# EAGLE design expansion_module_test_pads (EAGLE 9.6.2)
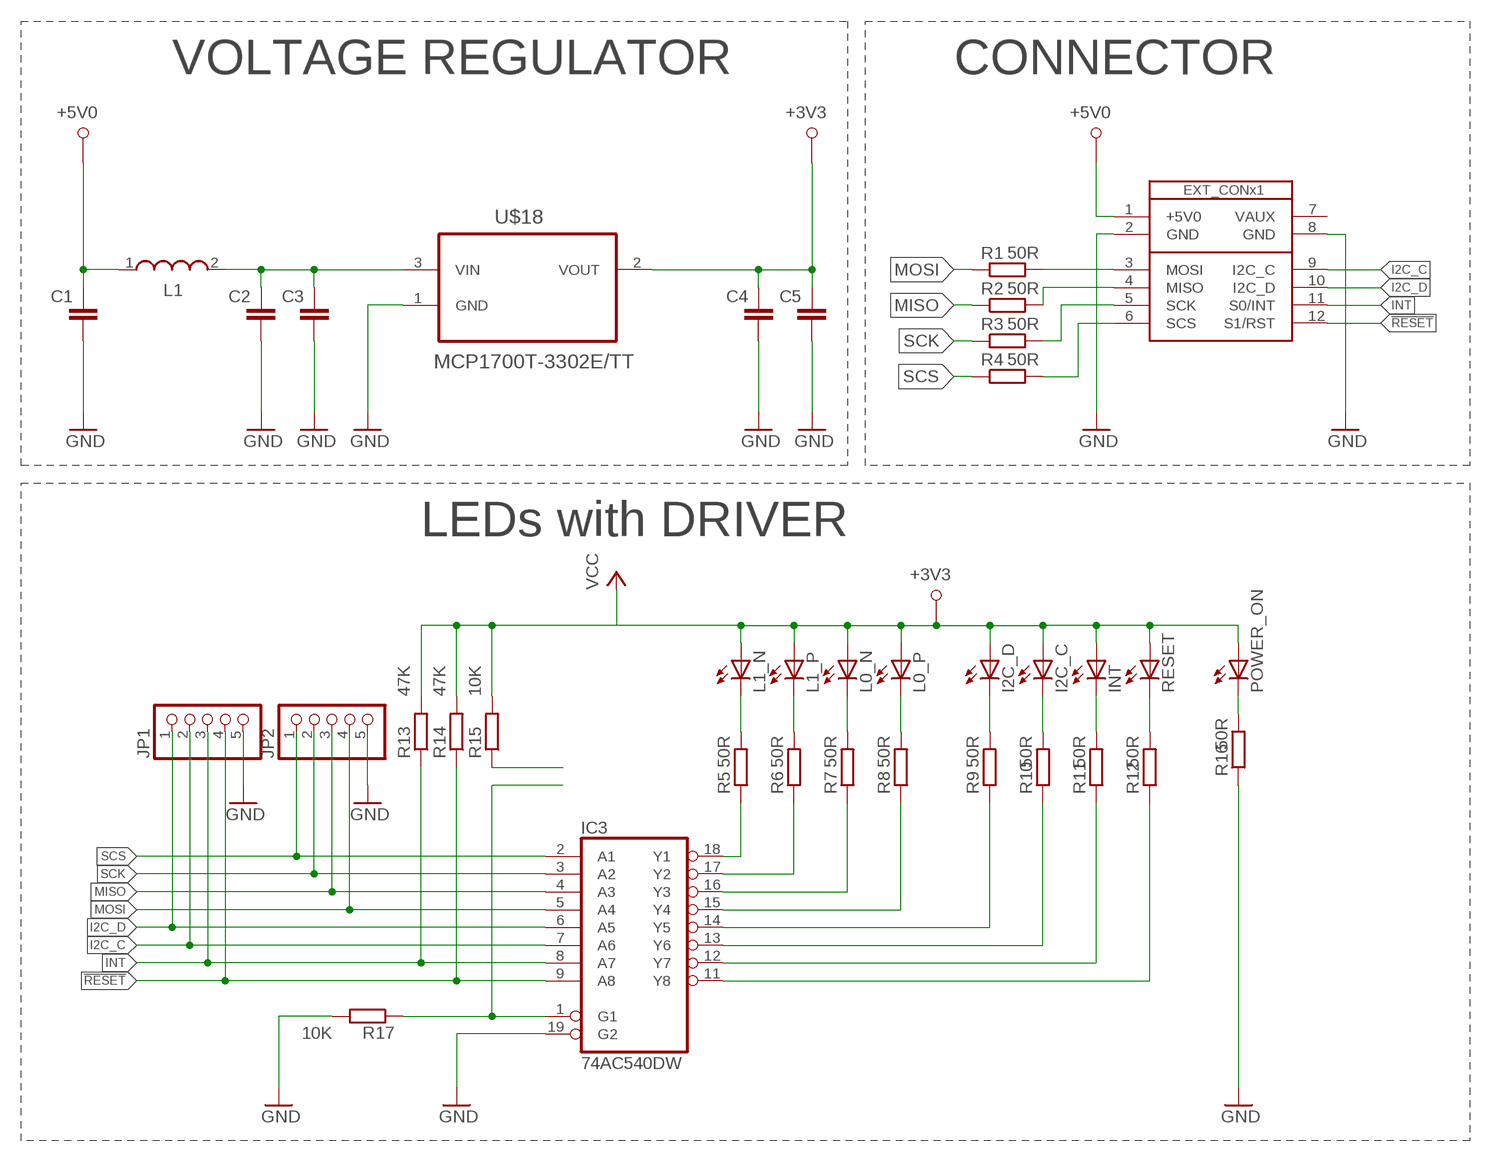
[diagram p0: schematic, sheet 1]

## Parts
C1  C-EUC0805  [C0805]
C2  C-EUC0805  [C0805]
C3  C-EUC0805  [C0805]
C4  C-EUC0805  [C0805]
C5  C-EUC0805  [C0805]
I2C_C  LEDCHIPLED_0805  [CHIPLED_0805]
I2C_D  LEDCHIPLED_0805  [CHIPLED_0805]
IC3  74AC540DW  [SO20W]
INT  LEDCHIPLED_0805  [CHIPLED_0805]
JP1  PINHD-1X5  [1X05]
JP2  PINHD-1X5  [1X05]
L0_N  LEDCHIPLED_0805  [CHIPLED_0805]
L0_P  LEDCHIPLED_0805  [CHIPLED_0805]
L1  WE-LQ_1210  [WE-LQ_M]
L1_N  LEDCHIPLED_0805  [CHIPLED_0805]
L1_P  LEDCHIPLED_0805  [CHIPLED_0805]
POWER_ON  LEDCHIPLED_0805  [CHIPLED_0805]
R1  50R  R-EU_R0805  [R0805]
R2  50R  R-EU_R0805  [R0805]
R3  50R  R-EU_R0805  [R0805]
R4  50R  R-EU_R0805  [R0805]
R5  50R  R-EU_R0805  [R0805]
R6  50R  R-EU_R0805  [R0805]
R7  50R  R-EU_R0805  [R0805]
R8  50R  R-EU_R0805  [R0805]
R9  50R  R-EU_R0805  [R0805]
R10  50R  R-EU_R0805  [R0805]
R11  50R  R-EU_R0805  [R0805]
R12  50R  R-EU_R0805  [R0805]
R13  47K  R-EU_R0805  [R0805]
R14  47K  R-EU_R0805  [R0805]
R15  10K  R-EU_R0805  [R0805]
R16  50R  R-EU_R0805  [R0805]
R17  10K  R-EU_R0805  [R0805]
RESET  LEDCHIPLED_0805  [CHIPLED_0805]
U$1  SB_EXT_CON_X1_SPI  [SB_EXT_CON_X1_FULL]
U$18  MCP1700T-3302E/TT  [SOT95P237X112-3N]

## Nets
!RESET: IC3.9(A8) JP1.4 R14.1 U$1.12(S1/RST)
+3V3: C4.2 C5.2 I2C_C.A I2C_D.A INT.A L0_N.A L0_P.A L1_N.A L1_P.A POWER_ON.A R13.2 R14.2 R15.2 RESET.A U$18.2(VOUT)
+5V0: C1.2 L1.1 U$1.1(+5V0)
GND: C1.1 C2.1 C3.1 C4.1 C5.1 IC3.19(G2) JP1.5 JP2.5 R16.1 R17.2 U$1.2(GND) U$1.8(GND) U$18.1(GND)
I2C_C: IC3.7(A6) JP1.2 U$1.9(I2C_C)
I2C_D: IC3.6(A5) JP1.1 U$1.10(I2C_D)
INT: IC3.8(A7) JP1.3 R13.1 U$1.11(S0/INT)
MISO: IC3.4(A3) JP2.3 R2.1
MOSI: IC3.5(A4) JP2.4 R1.1
N$1: R1.2 U$1.3(MOSI)
N$2: R2.2 U$1.4(MISO)
N$3: R3.2 U$1.5(SCK)
N$4: R4.2 U$1.6(SCS)
N$5: IC3.18(Y1) R5.1
N$6: IC3.17(Y2) R6.1
N$7: IC3.16(Y3) R7.1
N$8: C2.2 C3.2 L1.2 U$18.3(VIN)
N$9: IC3.15(Y4) R8.1
N$11: IC3.14(Y5) R9.1
N$12: IC3.13(Y6) R10.1
N$13: IC3.12(Y7) R11.1
N$14: IC3.11(Y8) R12.1
N$15: L1_N.C R5.2
N$16: L1_P.C R6.2
N$17: L0_N.C R7.2
N$18: L0_P.C R8.2
N$19: I2C_D.C R9.2
N$20: I2C_C.C R10.2
N$21: INT.C R11.2
N$22: R12.2 RESET.C
N$23: POWER_ON.C R16.2
N$24: IC3.1(G1) R17.1
N$25: R15.1
SCK: IC3.3(A2) JP2.2 R3.1
SCS: IC3.2(A1) JP2.1 R4.1
Unconnected: U$1.7(VAUX)

## Notes on the sheet
- VOLTAGE REGULATOR | CONNECTOR
- LEDs with DRIVER

## Power pins joined to a net without a drawn wire
GND: IC3.10(GND)
VCC: IC3.20(VCC)

## Library data of the parts
C1-C5 = resistor:C-EU: CAPACITOR, European symbol
I2C_C I2C_D INT L0_N L0_P L1_N L1_P POWER_ON RESET = led:LED: LED OSRAM: - CHIPLED LG R971, LG N971, LY N971, LG Q971, LY Q971, LO R971, LY R971 LH N974, LH R974 LS Q976, LO Q976, LY Q976 LO Q996 - Hyper CHIPLED LW Q18S LB Q993, LB Q99A, LB R99A - SideLED LS A670, LO A670, LY A670, LG A670, LP A670 LB A673, LV A673, LT A673, LW A673 LH A674 LY A675 LS A676, LA A676, LO A676, LY A676, LW A676 LS A679, LY A679, LG A679 - Hyper Micro SIDELED® LS Y876, LA Y876, LO Y876, LY Y876 LT Y87S - SmartLED LW L88C, LW L88S LB L89C, LB L89S, LG L890 LS L89K, LO L89K, LY L89K LS L896, LA L896, LO L896, LY L896 - TOPLED LS T670, LO T670, LY T670, LG T670, LP T670 LSG T670, LSP T670, LSY T670, LOP T670, LYG T670 LG T671, LOG T671, LSG T671 LB T673, LV T673, LT T673, LW T673 LH T674 LS T676, LA T676, LO T676, LY T676, LB T676, LH T676, LSB T676, LW T676 LB T67C, LV T67C, LT T67C, LS T67K, LO T67K, LY T67K, LW E67C LS E67B, LA E67B, LO E67B, LY E67B, LB E67C, LV E67C, LT E67C LW T67C LS T679, LY T679, LG T679 LS T770, LO T770, LY T770, LG T770, LP T770 LB T773, LV T773, LT T773, LW T773 LH T774 LS E675, LA E675, LY E675, LS T675 LS T776, LA T776, LO T776, LY T776, LB T776 LHGB T686 LT T68C, LB T68C - Hyper Mini TOPLED® LB M676 - Mini TOPLED Santana® LG M470 LS M47K, LO M47K, LY M47K Source: http://www.osram.convergy.de LUXEON: - LUMILED® LXK2-PW12-R00, LXK2-PW12-S00, LXK2-PW14-U00, LXK2-PW14-V00 LXK2-PM12-R00, LXK2-PM12-S00, LXK2-PM14-U00 LXK2-PE12-Q00, LXK2-PE12-R00, LXK2-PE12-S00, LXK2-PE14-T00, LXK2-PE14-U00 LXK2-PB12-K00, LXK2-PB12-L00, LXK2-PB12-M00, LXK2-PB14-N00, LXK2-PB14-P00, LXK2-PB14-Q00 LXK2-PR12-L00, LXK2-PR12-M00, LXK2-PR14-Q00, LXK2-PR14-R00 LXK2-PD12-Q00, LXK2-PD12-R00, LXK2-PD12-S00 LXK2-PH12-R00, LXK2-PH12-S00 LXK2-PL12-P00, LXK2-PL12-Q00, LXK2-PL12-R00 Source: www.luxeon.com KINGBRIGHT: KA-3528ASYC Source: www.kingbright.com
IC3 = 74xx-eu:74*540: Inverting Octal BUFFER and LINE DRIVER, 3-state
JP1 JP2 = pinhead:PINHD-1X5: PIN HEADER
L1 = EagleLibrary_Wuerth_Elektronik_eiSos_rev16a:WE-LQ: SMD Inductor Characteristics Miniature chip inductor wound on a special ferrite core Small inductances for compact circuits High Q at high frequencies Low DC-resistance Operating temperature: –40 ºC to +125 ºC Applications Low power DC/DC-converters from Linear Technology, National Semiconductor, Texas Instruments, Fairchild Semiconductor, ON Semiconductor, STMicroelectronics, Maxim, MPS, Semtech, Exar, Analogic Tech, Diodes and Cologne Chip EMI-Filtering RF-circuits <http://katalog.we-online.de/media/images/eisos/IndLQ_pf2.jpg> Details see: http://katalog.we-online.de/en/pbs/WE-LQ? Updated by Dan Xu 2014-07-08 2014 (C) Wurth Elektronik
R1-R17 = resistor:R-EU_: RESISTOR, European symbol
U$1 = al_smartboard:SB_EXT_CON_X1_SPI
U$18 = Microchip_By_element14_Batch_1:MCP1700T-3302E/TT: Low Quiescent Current LDO; MPN: MCP1700T-3302E/TT; OC_FARNELL: 1296592; OC_NEWARK: 88H9817; PACKAGE: SOT23-3; SUPPLIER: Microchip

## Net classes
0 default: clearance 0.205 mm

## Board
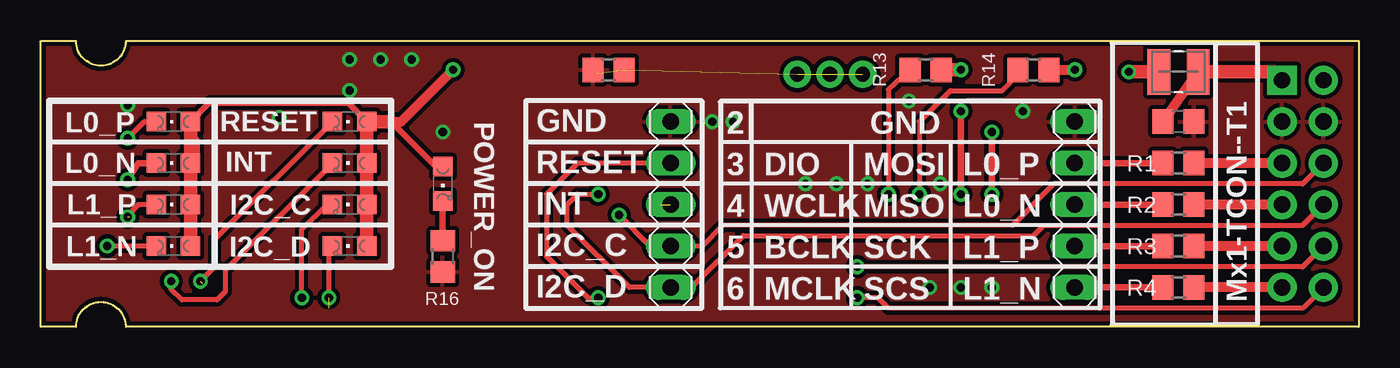
[diagram p1: board, top side]
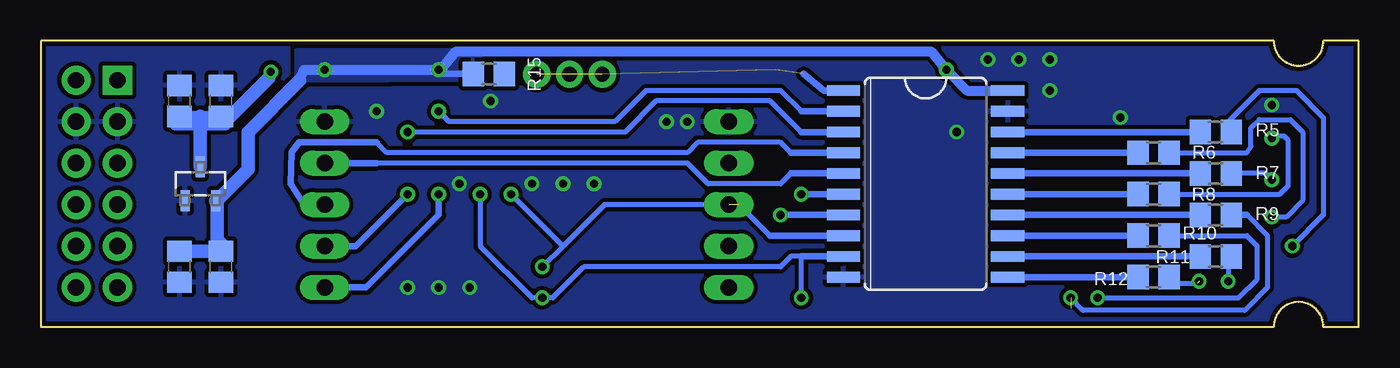
[diagram p2: board, bottom side, seen from below]

Size 80.77 x 17.53 mm. Coordinates in mm from the lower left corner, seen from the top.
Copper layers (1*16): Top 0.035mm / dielectric 1.5mm / Bottom 0.035mm
Design rules "default *": minimum track width 10mil, minimum drill 24mil, track to track 10mil, track to pad 8mil, pad to pad 8mil, via to via 8mil, smd to smd 8mil, copper to edge 10mil, drill to drill 10mil, minimum pad ring 10mil, minimum via ring 8mil, stop-mask expansion 4mil, vias tented up to drill 20mil, thermal gap 10mil

### Footprints (pad centres in the part's own frame; a part is rotated, then mirrored left to right if it is on the bottom)
C0805 = smd 1.3 x 1.5: 1 -0.95,0; 2 0.95,0
CHIPLED_0805 = smd 1.2 x 1.2: A 0,-1.05; C 0,1.05
SO20W = smd 0.66 x 2.032: 1 -5.715,-5.029; 2 -4.445,-5.029; 3 -3.175,-5.029; 4 -1.905,-5.029; 5 -0.635,-5.029; 6 0.635,-5.029; 7 1.905,-5.029; 8 3.175,-5.029; 9 4.445,-5.029; 10 5.715,-5.029; 11 5.715,5.029; 12 4.445,5.029; 13 3.175,5.029; 14 1.905,5.029; 15 0.635,5.029; 16 -0.635,5.029; 17 -1.905,5.029; 18 -3.175,5.029; 19 -4.445,5.029; 20 -5.715,5.029
1X05 = drill 1.016 long: 1 -5.08,0; 2 -2.54,0; 3 0,0; 4 2.54,0; 5 5.08,0
WE-LQ_M = smd 1.4 x 2.8: 1 -1.2,0; 2 1.2,0
R0805 = smd 1.3 x 1.5: 1 -0.95,0; 2 0.95,0
SB_EXT_CON_X1_FULL = drill 1 pad 1.778 square: 1 15.24,5.08 | drill 1 pad 1.778: 2 12.7,5.08; 3 10.16,5.08; 4 7.62,5.08; 5 5.08,5.08; 6 2.54,5.08; 7 15.24,2.54; 8 12.7,2.54; 9 10.16,2.54; 10 7.62,2.54; 11 5.08,2.54; 12 2.54,2.54
SOT95P237X112-3N = smd 0.559 x 1.27: 1 -0.94,-1.041; 2 0.94,-1.041; 3 0,1.041

### Placement (x,y rotation side)
C1  69.72,12.57 180 top
C2  72.26,13.84 270 bottom
C3  69.72,13.84 270 bottom
C4  69.72,3.68 90 bottom
C5  72.26,3.68 90 bottom
I2C_C  18.92,7.49 90 top
I2C_D  18.92,4.95 90 top
IC3  26.54,8.76 270 bottom
INT  18.92,10.03 90 top
JP1  38.61,7.49 90 top
JP2  63.37,7.49 90 top
L0_N  8.13,10.03 90 top
L0_P  8.13,12.57 90 top
L1  69.72,15.62 180 top
L1_N  8.13,4.95 90 top
L1_P  8.13,7.49 90 top
POWER_ON  24.64,8.76 180 top
R1  69.72,10.03 0 top
R2  69.72,7.49 0 top
R3  69.72,4.95 0 top
R4  69.72,2.41 0 top
R5  8.76,11.94 0 bottom
R6  12.57,10.67 0 bottom
R7  8.76,9.4 0 bottom
R8  12.57,8.13 0 bottom
R9  8.76,6.86 0 bottom
R10  12.57,5.59 0 bottom
R11  8.76,4.32 0 bottom
R12  12.57,3.05 0 bottom
R13  54.23,15.75 0 top
R14  60.83,15.75 0 top
R15  53.31,15.49 180 bottom
R16  24.64,4.32 90 top
R17  34.8,15.75 180 top
RESET  18.92,12.57 90 top
U$1  81.15,-0.13 90 top
U$18  70.99,8.76 0 bottom

### Tracks (layer width: path | path; a pad name or v marks a point on that pad's centre or on a via)
!RESET  (via drill 0.5)
  Top 0.305: U$1.12 77.34,1.14 51.94,1.14 51.31,1.78 v50.04,1.78 | v53.85,8.13 53.85,12.57 55.75,14.48 58.93,14.48 59.88,15.43 R14.1 | JP1.4 32.89,10.03 30.99,8.13 30.99,4.32 33.53,1.78 v34.16,1.78
  Bottom 0.305: v53.85,8.13 53.85,4.95 50.67,1.78 v50.04,1.78 49.4,1.78 47.5,3.68 35.43,3.68 34.8,4.32 34.16,4.32 v34.16,1.78
  Bottom 0.406: IC3.9 34.16,4.32
+3V3  (via drill 0.5)
  Top 0.406: POWER_ON.A 24.22,9.81 21.46,12.57 | RESET.A 18.83,13.72 10.32,13.72 L0_P.A | RESET.A INT.A | INT.A I2C_C.A | I2C_C.A I2C_D.A | RESET.A INT.A | INT.A I2C_C.A
  Top 0.61: R14.2 v63.37,15.75 | 9.18,11.52 9.33,11.37 9.4,11.3 | 21.46,12.57 22.1,12.57 v25.27,15.75
  Top 0.813: R13.2 v56.39,15.75 | L0_N.A 9.18,11.52 L0_P.A | L0_N.A L1_P.A L1_N.A | L0_N.A 9.33,10.19 9.33,11.37 | I2C_D.A I2C_C.A INT.A RESET.A 21.46,12.57
  Bottom 0.406: R15.2 56.13,15.49 v56.39,15.75
  Bottom 0.61: 64.9,15.11 64.64,15.75 v63.37,15.75 v56.39,15.75 56.26,15.75 55.37,16.84 26.16,16.84 v25.27,15.75 24,14.48 21.46,14.48
  Bottom 0.813: C5.2 C4.2 69.72,5.1 69.98,5.1 69.98,7.72 | U$18.2 69.98,7.72 | 69.98,7.72 69.98,7.75 68.07,9.65 68.07,11.94 64.9,15.11
  pour Bottom: 53.85,17.02 53.85,15.11 65.1,15.06 65.1,16.97
+5V0
  Top 0.61: L1.1 C1.2
  Top 0.813: U$1.1 75.56,15.62 L1.1
GND  (via drill 0.5)
  other vias: 41.15,12.57 42.42,12.57 54.48,2.41 56.39,2.41 58.29,2.41 60.2,13.21 24.64,11.94 14.61,12.83 55.12,8.76 53.21,13.84 50.67,8.76 48.77,8.76 46.86,8.76 18.92,14.48 18.92,16.38 20.83,16.38 22.73,16.38 5.33,13.59
  pour Bottom (isolate 0.254, rank 2): 80.9,17.65 -1.4,18.29 -1.52,-0.38 81.15,-0.38
  pour Top (isolate 0.254): -0.76,18.03 80.64,18.03 80.9,-0.13 -1.02,-0.13
I2C_C  (via drill 0.5)
  Top 0.305: U$1.9 77.34,8.76 62.1,8.76 59.56,6.22 41.78,6.22 40.51,4.95 JP1.2 37.34,4.95 v35.43,6.86
  Bottom 0.406: v35.43,6.86 IC3.7
I2C_D  (via drill 0.5)
  Top 0.305: U$1.10 77.34,6.22 61.47,6.22 60.83,5.59 43.05,5.59 39.88,2.41 JP1.1 36.07,2.41 32.26,6.22 32.26,7.49 32.89,8.13 v34.16,8.13
  Bottom 0.406: IC3.6 v34.16,8.13
INT  (via drill 0.5)  (1 unrouted)
  Top 0.305: U$1.11 77.34,3.68 v50.04,3.68 | R13.1 51.94,14.54 v51.94,8.13
  Bottom 0.305: v50.04,3.68 48.77,4.95 | v51.94,8.13 48.77,4.95 | 36.07,5.59 37.97,7.49 46.23,7.49 48.77,4.95
  Bottom 0.406: 36.07,5.59 IC3.8
MISO
  Top 0.406: JP2.3 R2.1
  Bottom 0.305: 34.8,10.67 35.43,11.3 40.51,11.3 41.15,10.67 59.56,10.67 60.2,11.3
  Bottom 0.406: JP2.3 64.64,7.49 65.46,8.76 65.41,10.69 64.95,11.3 60.2,11.3 | 34.8,10.67 IC3.4
MOSI
  Top 0.406: JP2.4 R1.1
  Bottom 0.305: 34.8,9.4 35.43,8.76 39.88,8.76 41.15,10.03 60.2,10.03
  Bottom 0.406: JP2.4 60.2,10.03 | 34.8,9.4 IC3.5
N$1
  Top 0.61: U$1.3 R1.2
N$2
  Top 0.61: U$1.4 R2.2
N$3
  Top 0.61: U$1.5 R3.2
N$4
  Top 0.61: U$1.6 R4.2
N$5
  Bottom 0.406: IC3.18 R5.1
N$6
  Bottom 0.406: IC3.17 R6.1
N$7
  Bottom 0.406: IC3.16 R7.1
N$8  (via drill 0.5)
  Top 0.813: L1.2 v66.67,15.62
  Bottom 0.406: C2.2 70.99,12.89 C3.2
  Bottom 0.813: U$18.3 70.99,12.89 | v66.67,15.62 66.8,15.24 69.34,12.7 69.66,12.83 C3.2
N$9
  Bottom 0.406: IC3.15 R8.1
N$11
  Bottom 0.406: IC3.14 R9.1
N$12
  Bottom 0.406: IC3.13 R10.1
N$13
  Bottom 0.406: IC3.12 R11.1
N$14
  Bottom 0.406: IC3.11 R12.1
N$15  (via drill 0.5)
  Top 0.305: L1_N.C v4.06,4.95
  Bottom 0.305: 7.81,12.25 R5.2 7.87,12 7.87,12.7 6.1,14.48 3.81,14.48 2.16,12.83 2.16,6.86 v4.06,4.95
N$16  (1 unrouted)
  Top 0.305: L1_P.C 5.97,7.49 5.59,7.11 5.59,6.98 5.33,6.73
  Bottom 0.305: R6.2 6.86,10.67 6.6,11.05 6.6,12.19 6.1,12.7 4.19,12.7 3.43,11.94 3.43,7.75 4.45,6.73 5.46,6.73
N$17  (via drill 0.5)
  Top 0.406: L0_N.C 5.97,10.03 v5.33,9.02
  Bottom 0.305: v5.33,9.02 5.71,9.4 R7.2
N$18  (via drill 0.5)
  Top 0.305: v5.33,11.56 6.35,12.57 L0_P.C
  Bottom 0.305: R8.2 4.83,8.13 4.32,8.64 4.32,11.43 4.57,11.68 5.21,11.68 v5.33,11.56
N$19  (via drill 0.5)  (1 unrouted)
  Top 0.305: I2C_D.C 17.65,4.73 v17.65,1.78
  Bottom 0.305: 7.81,6.8 R9.2 | 6.86,6.86 5.59,5.59 5.59,2.41 6.98,1.02 16.89,1.02 v17.65,1.78
  Bottom 0.406: R9.2 6.86,6.86
N$20  (via drill 0.5)
  Top 0.305: v16,1.78 16,5.97 17.53,7.49 I2C_C.C
  Bottom 0.305: R10.2 6.86,5.59 6.22,4.95 6.22,2.92 7.37,1.78 v16,1.78
N$21  (via drill 0.5)
  Top 0.305: INT.C 11.3,3.46 11.3,2.16 10.79,1.65 8.64,1.65 8,2.29 v8,2.79
  Bottom 0.305: 8.13,4 R11.2 8,4.13 v8,2.79
N$22  (1 unrouted)
  Top 0.305: RESET.C 10.67,5.37 10.67,3.68 9.78,2.79
  Bottom 0.305: R12.2 11.24,2.67 9.91,2.67
N$23
  Top 0.406: R16.2 POWER_ON.C
N$24  (via drill 0.9 pad 1.68)  (4 unrouted)
  Bottom 0.406: IC3.1 32.77,14.48 34.04,15.49
  other vias: 50.36,15.48 48.36,15.48 46.36,15.48
N$27
  Bottom 0.813: 72.39,12.83 69.6,12.83
N$28
  Bottom 0.813: 72.52,12.45 69.47,12.45
N$29  (via drill 0.5)
  other vias: 5.33,6.73
N$30  (via drill 0.5)
  other vias: 9.78,2.79
SCK  (via drill 0.5)
  Top 0.406: JP2.2 R3.1 | v58.29,8.13 v58.29,11.94
  Bottom 0.305: 34.16,11.94 36.07,13.84 43.05,13.84 44.96,11.94 v58.29,11.94
  Bottom 0.406: JP2.2 61.47,4.95 v58.29,8.13 | 34.16,11.94 IC3.3
SCS  (via drill 0.5)
  Top 0.406: JP2.1 R4.1 | v56.39,8.13 v56.39,13.21
  Bottom 0.305: 34.16,13.21 35.43,14.48 43.69,14.48 45.59,12.57 55.75,12.57 v56.39,13.21
  Bottom 0.406: JP2.1 60.83,2.41 56.39,6.86 v56.39,8.13 | 34.16,13.21 IC3.2

### Text on the board
tPlace: GND | 2 | GND | RESET | 3 | DIO | MOSI | L0_P | INT | 4 | WCLK | MISO | L0_N | I2C_C | 5 | BCLK | SCK | L1_P | I2C_D | 6 | MCLK | SCS | L1_N | Mx1-TCON--T1